# EAGLE design 218_hall (EAGLE 9.6.2)
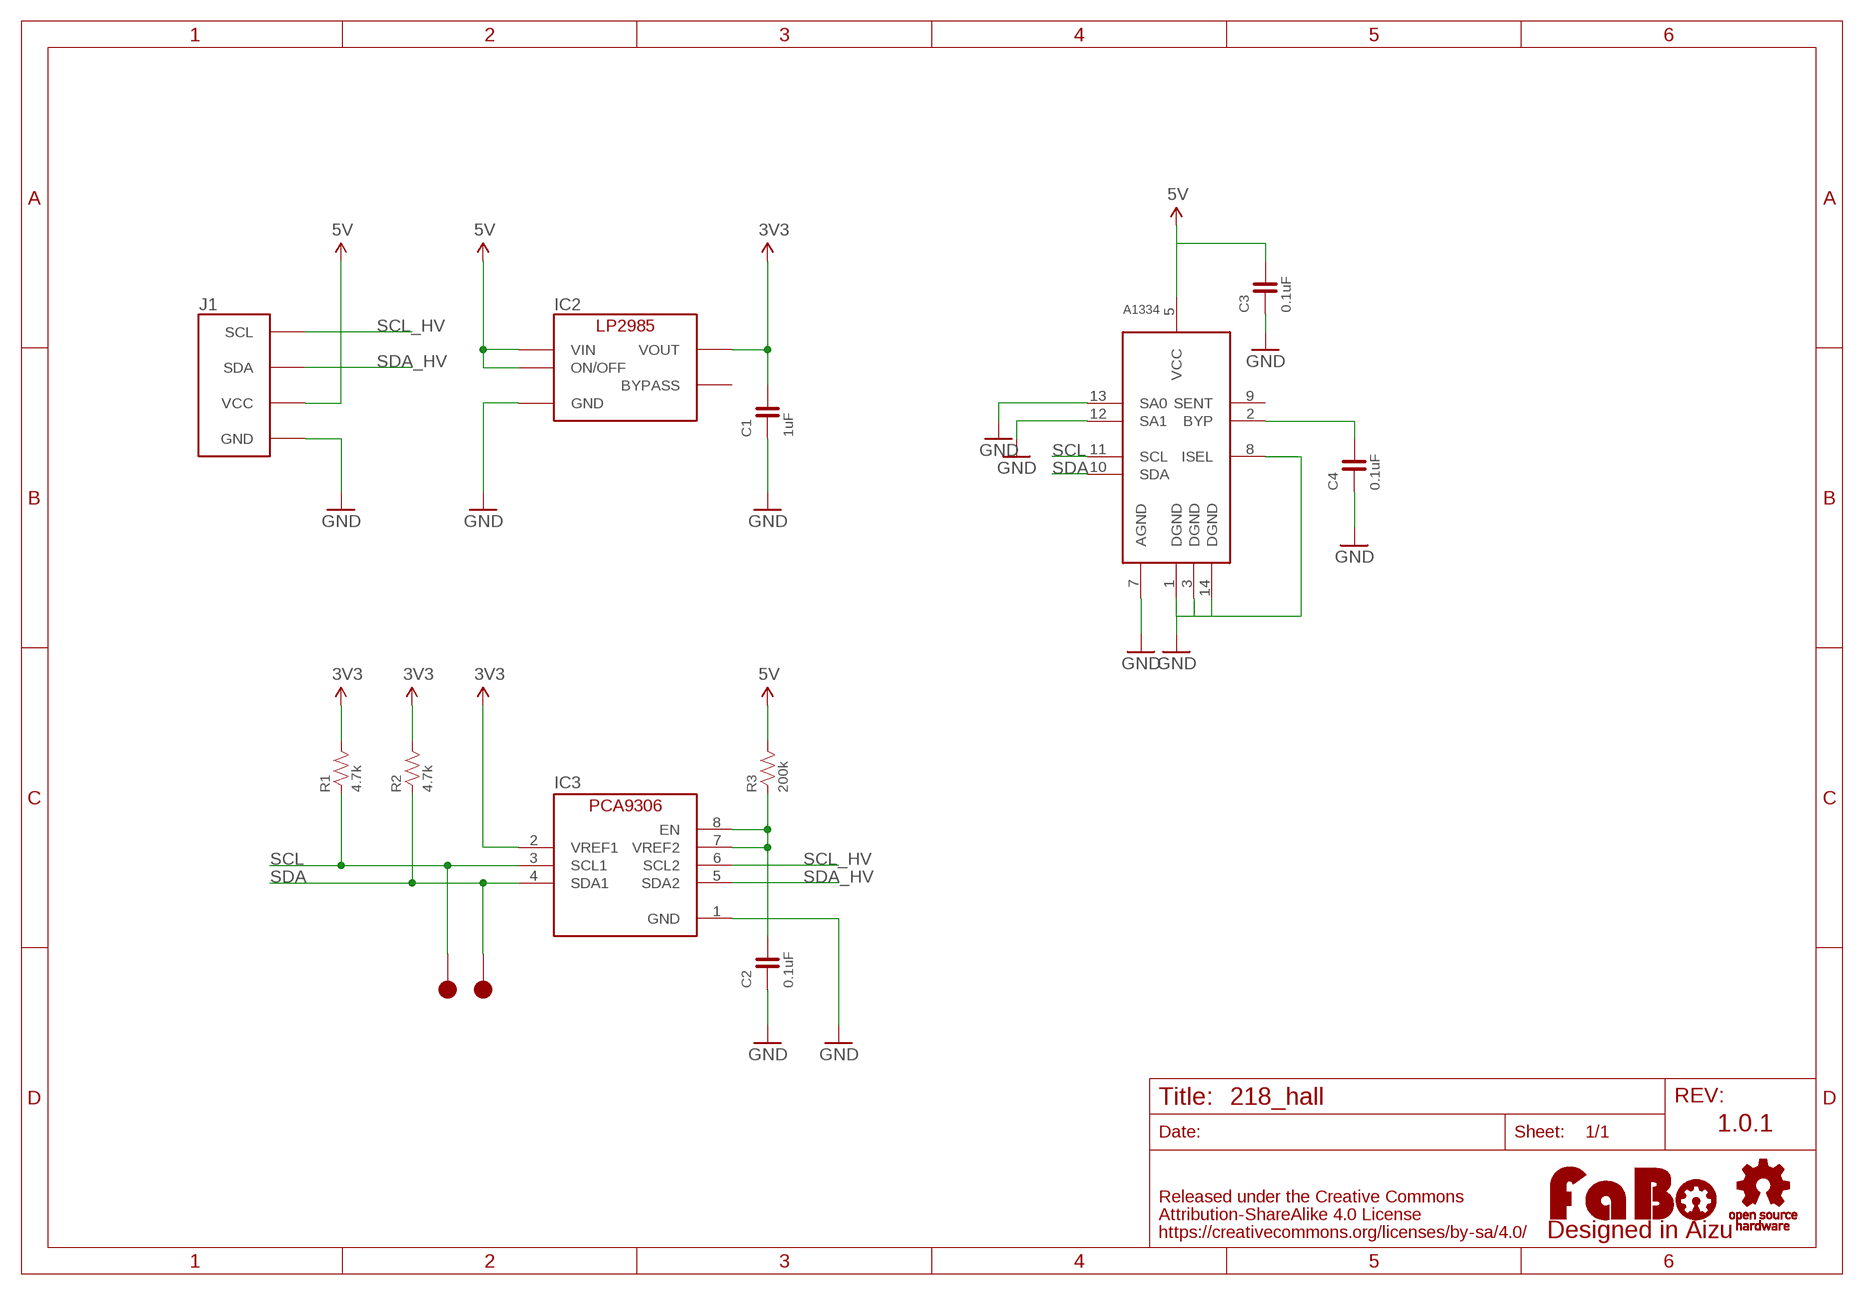
[diagram p0: schematic, sheet 1]

## Parts
A1334  A1335  [LE-14]
C1  1uF  CAPACITOR-0603  [0603]
C2  0.1uF  CAPACITOR-0603  [0603]
C3  0.1uF  CAPACITOR-0603  [0603]
C4  0.1uF  CAPACITOR-0603  [0603]
IC2  LP2985-33DBV  [SOT-23-5]
IC3  PCA9306GM  [XQFN8]
J1  FABO_BRICK_I2C  [FABO_BRICK_I2C]
LOGO1  LOGO_FABO-M  [LOGO_FABO_M]
R1  4.7k  RESISTOR-0603  [0603]
R2  4.7k  RESISTOR-0603  [0603]
R3  200k  RESISTOR-0603  [0603]
TP1  TP-15  [TP-15]
TP2  TP-15  [TP-15]
U$2  LOGO_OSHW-M_BOTTOM  [LOGO_OSHW_M_BOTTOM]

## Nets
3V3: C1.2 IC2.5(VOUT) IC3.2(VREF1) R1.2 R2.2
5V: A1334.5(VCC) C3.2 IC2.1(VIN) IC2.3(ON/OFF) J1.VCC R3.2
GND: A1334.1(DGND) A1334.3(DGND) A1334.7(AGND) A1334.8(ISEL) A1334.12(SA1) A1334.13(SA0) A1334.14(DGND) C1.1 C2.1 C3.1 C4.1 IC2.2(GND) IC3.1(GND) J1.GND
N$1: A1334.2(BYP) C4.2
N$2: C2.2 IC3.7(VREF2) IC3.8(EN) R3.1
SCL: A1334.11(SCL) IC3.3(SCL1) R1.1 TP2.1
SCL_HV: IC3.6(SCL2) J1.SCL
SDA: A1334.10(SDA) IC3.4(SDA1) R2.1 TP1.1
SDA_HV: IC3.5(SDA2) J1.SDA
Unconnected: A1334.9(SENT) IC2.4(BYPASS)

## Notes on the sheet
- 1.0.1

## Library data of the parts
A1334 = FaBo-Sensor:A1335
C1-C4 = FaBo-Capacitor:CAPACITOR: CAPACITOR
IC2 = FaBo-Supply:LP2985: LP2985
IC3 = FaBo-LevelTranslator:PCA9306
J1 = FaBo-Template:FABO_BRICK_I2C: FaBo Brick I2C
LOGO1 = component:LOGO_FABO
R1-R3 = FaBo-Resistors:RESISTOR: RESISTOR
TP1 TP2 = FaBo-Supply:TP
U$2 = FaBo-etc:LOGO_OSHW

## Board
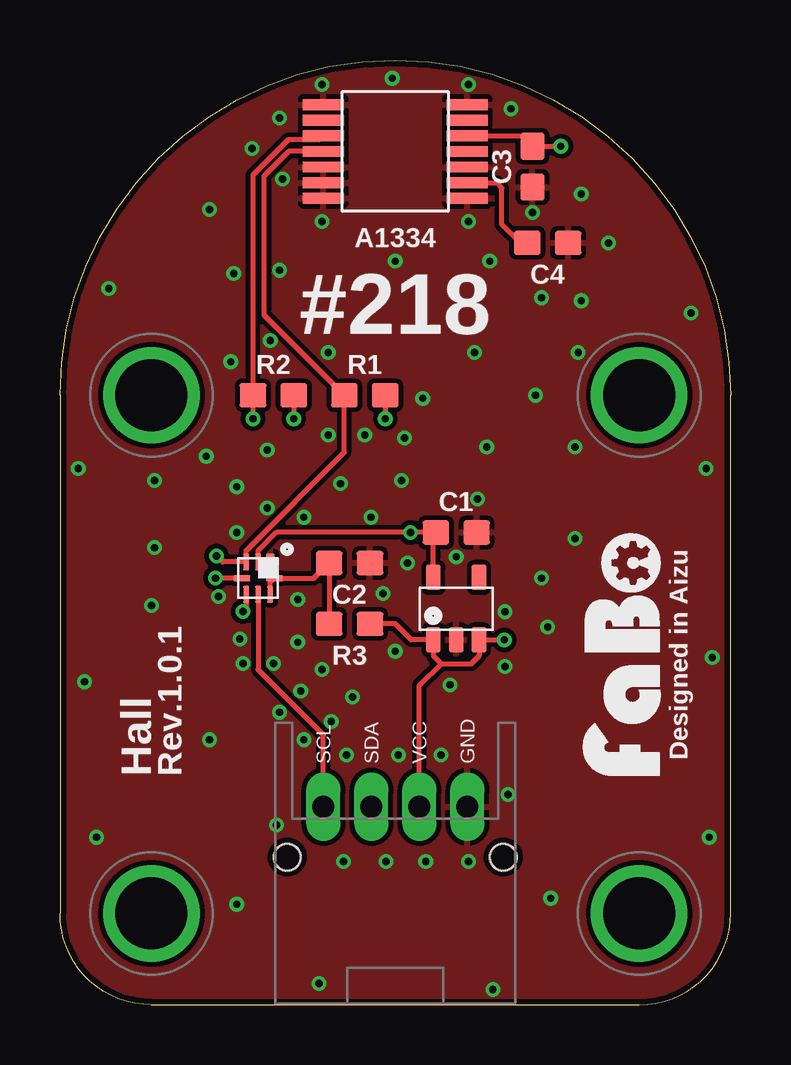
[diagram p1: board, top side]
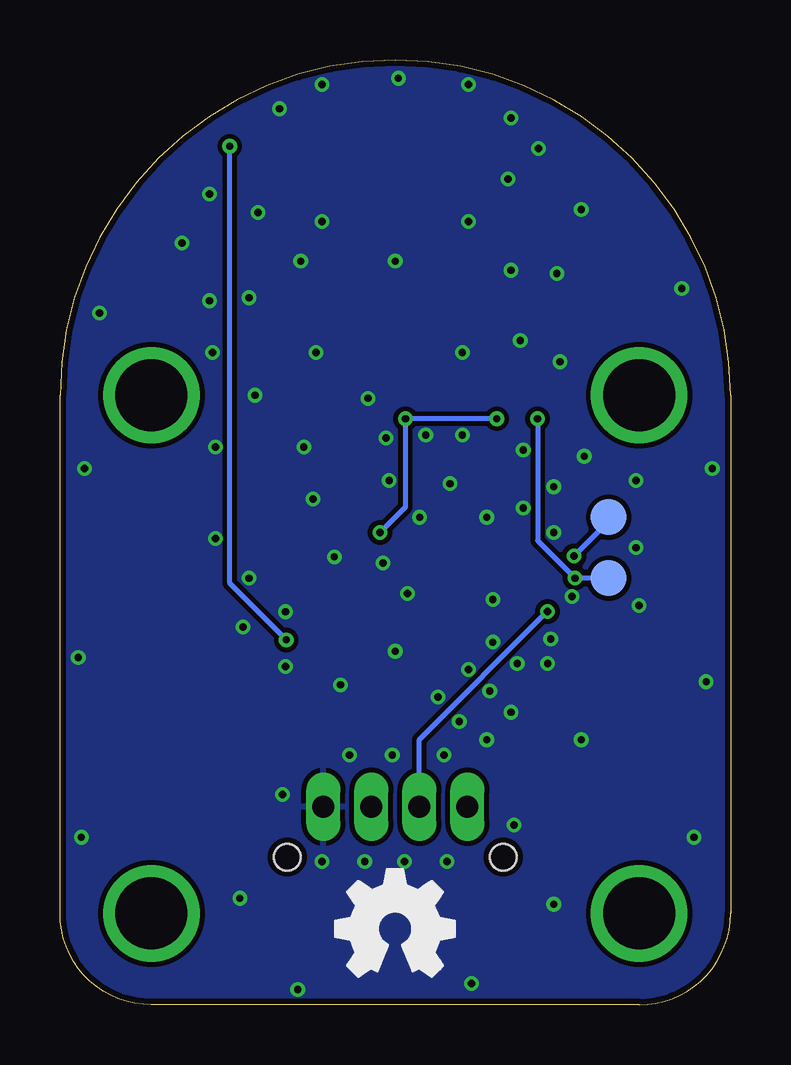
[diagram p2: board, bottom side, seen from below]

Size 27.94 x 39.37 mm. Coordinates in mm from the lower left corner, seen from the top.
Copper layers (1*16): Top 0.035mm / dielectric 1.6mm / Bottom 0.035mm
Design rules "PCBway": minimum track width 6mil, minimum drill 12mil, track to track 6mil, track to pad 6mil, pad to pad 6mil, via to via 6mil, smd to smd 6mil, copper to edge 10mil, drill to drill 10mil, minimum pad ring 10mil, minimum via ring 6mil, stop-mask expansion 2mil, vias tented up to drill 100mil, thermal gap 8mil

### Footprints (pad centres in the part's own frame; a part is rotated, then mirrored left to right if it is on the bottom)
LE-14 = smd 0.45 x 1.7: 1 -1.95,-3; 2 -1.3,-3; 3 -0.65,-3; 4 0,-3; 5 0.65,-3; 6 1.3,-3; 7 1.95,-3; 8 1.95,3; 9 1.3,3; 10 0.65,3; 11 0,3; 12 -0.65,3; 13 -1.3,3; 14 -1.95,3
0603 = smd 1.1 x 1: 1 -0.85,0; 2 0.85,0
SOT-23-5 = smd 0.6 x 1.05: 1 -0.95,-1.3; 2 0,-1.3; 3 0.95,-1.3; 4 0.95,1.3; 5 -0.95,1.3
XQFN8 = smd 0.7 x 0.35: 1 -0.675,0.5 | smd 0.7 x 0.25: 2 -0.675,0; 3 -0.675,-0.5; 5 0.675,-0.5; 6 0.675,0; 7 0.675,0.5 | smd 0.25 x 0.7: 4 0,-0.675; 8 0,0.675
FABO_BRICK_I2C = drill 0.9 pad 1.422 long: GND 3,-10.795; SCL -3,-10.795; SDA -1,-10.795; VCC 1,-10.795 | drill 3 pad 3.81: P$1 -10.16,6.35; P$2 10.16,6.35; P$3 -10.16,-15.24; P$4 10.16,-15.24 | hole 1.1: -4.5,-12.895; 4.5,-12.895
TP-15 = smd 1.5 x 1.5: 1 0,0

### Placement (x,y rotation side)
A1334  13.97,35.56 90 top
C1  16.51,19.68 180 top
C2  12.06,18.41 180 top
C3  19.68,34.92 90 top
C4  20.32,31.75 180 top
IC2  16.51,16.51 0 top
IC3  8.26,17.78 270 top
J1  13.97,19.05 0 top
LOGO1  25.4,14.61 90 top
R1  12.7,25.4 0 top
R2  8.89,25.4 0 top
R3  12.06,15.88 0 top
TP1  5.08,17.78 0 bottom
TP2  5.08,20.32 0 bottom
U$2  13.97,3.17 0 top

### Tracks (layer width: path | path; a pad name or v marks a point on that pad's centre or on a via)
3V3  (via drill 0.3)
  Top 0.203: IC2.5 15.56,19.59 C1.2 v14.61,19.68 9.02,19.68 8.26,18.92 IC3.2 | R2.2 v9.74,24.42 | R1.2 v13.55,24.42
  Bottom 0.203: v9.74,24.42 v13.55,24.42 13.55,20.74 v14.61,19.68
5V  (via drill 0.3)
  Top 0.203: 15.88,14.22 15.56,14.54 IC2.1 14.63,15.21 13.97,15.88 R3.2 | 15.88,14.22 17.14,14.22 17.46,14.54 IC2.3 v18.51,15.21 | J1.VCC 14.97,13.32 15.88,14.22 | A1334.5 19.25,36.21 C3.2 v20.87,35.77
  Bottom 0.203: v18.51,15.21 20.87,17.57 v20.87,35.77
GND  (via drill 0.3)
  other vias: 10.03,13.08 8.89,14.22 11.3,11.81 7.62,14.22 9.91,15.11 10.92,13.97 12.19,12.83 7.49,15.24 9.91,16.89 13.46,17.14 13.97,14.73 9.14,12.19 10.16,11.05 11.94,10.41 14.1,10.41 15.88,10.41 16.26,13.34 18.54,16.38 18.54,14.1 20.32,15.75 20.07,17.78 16.51,18.67 14.48,18.41 12.95,20.32 10.16,20.32 8.64,20.7 7.37,19.68 6.6,17.02 7.37,21.59 8.64,23.11 11.18,23.75 12.7,23.75 11.68,21.72 14.35,23.62 14.22,21.84 17.4,21.08 3.94,19.05 3.94,21.84 3.81,16.64 8.76,27.69 11.18,27.18 15.11,25.27 7.11,26.8 7.24,30.48 9.14,30.61 9.27,34.42 8,35.69 9.14,36.96 10.92,38.35 13.84,38.61 17.02,38.35 18.8,37.34 21.72,33.78 19.68,33.02 17.02,32.64 10.92,32.64 13.97,30.99 17.91,30.99 20.07,29.46 21.72,29.34 22.86,31.75 6.22,33.15 19.81,25.4 21.46,23.24 21.59,27.18 21.46,19.43 26.29,28.83 26.92,22.35 17.27,27.18 17.78,23.24 27.18,14.48 27.05,6.99 18.67,8.76 17.02,5.97 15.24,5.97 13.59,5.97 11.81,5.97 9.02,7.49 6.22,11.05 1.52,6.99 7.37,4.19 20.45,4.45 18.03,0.64 10.79,0.89 1.02,13.46 0.76,22.35 6.1,22.86 2.03,29.84
  pour Bottom (isolate 0.203): 0,0 27.94,0 27.94,39.37 0,39.37
  pour Top (isolate 0.203): 0,0 27.94,0 27.94,39.37 0,39.37
N$1
  Top 0.203: A1334.2 18.19,34.26 18.41,34.04 18.41,32.51 19.18,31.75 C4.2
N$2
  Top 0.203: R3.1 C2.2 10.58,17.78 IC3.8 8.76,17.61 IC3.7
SCL  (via drill 0.3)
  Top 0.203: v6.52,18.71 6.77,18.45 IC3.3 7.75,18.93 11.85,23.02 R1.1 8.51,28.74 8.51,34.54 9.53,35.56 A1334.11
  Bottom 0.203: TP2.1 5.08,20.15 v6.52,18.71
SCL_HV
  Top 0.203: IC3.6 8.26,13.97 10.97,11.26 J1.SCL
SDA  (via drill 0.3)
  Top 0.203: IC3.4 v6.48,17.78 | A1334.10 10.8,36.04 9.5,36.04 8.04,34.58 R2.1 v8.04,24.42
  Bottom 0.203: TP1.1 v6.48,17.78 8.04,19.34 v8.04,24.42
SDA_HV  (via drill 0.3)
  Top 0.203: IC3.5 7.75,16.52 v7.63,16.39
  Bottom 0.203: J1.SDA 12.97,11.05 v7.63,16.39

### Text on the board
tPlace: #218 | Designed in Aizu | Hall | Rev.1.0.1